# EAGLE schematic Flywheel Sensor Schematic (EAGLE 9.7.0)
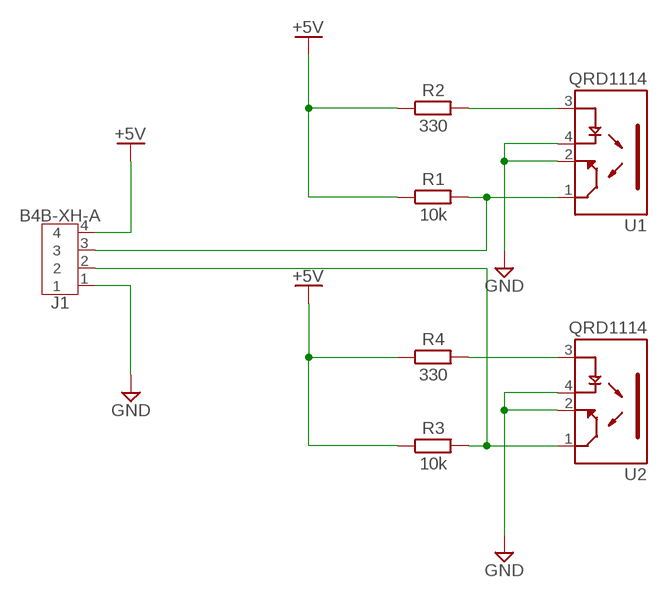
[diagram p0: schematic, sheet 1]

## Parts
J1  B4B-XH-A  [B4B-XH-A]
R1  10k  R_CHIP-0805(2012-METRIC)  [RESC2012X65]
R2  330  R_CHIP-0805(2012-METRIC)  [RESC2012X65]
R3  10k  R_CHIP-0805(2012-METRIC)  [RESC2012X65]
R4  330  R_CHIP-0805(2012-METRIC)  [RESC2012X65]
U1  QRD1114  [ONS_QRD1114]
U2  QRD1114  [ONS_QRD1114]

## Nets
+5V: J1.4 R1.1 R2.1 R3.1 R4.1
GND: J1.1 U1.2(ET) U1.4(C) U2.2(ET) U2.4(C)
N$1: J1.2 R3.2 U2.1(CT)
N$2: R4.2 U2.3(A)
N$3: J1.3 R1.2 U1.1(CT)
N$4: R2.2 U1.3(A)

## Library data of the parts
J1 = Connector:B4B-XH-A: XH Connector Top Entry - 4POS Details see: Datasheet <http://www.jst-mfg.com/product/pdf/eng/eXH.pdf>; CATEGORY: Header; DSECRIPTION: Connector Header Through Hole 4 position 0.098" (2.50mm); MANUFACTURER: JST Sales America Inc.; MPN: B4B-XH-A(LF)(SN); OPERATING_TEMPERATURE: -25 C to 85 C; PART_STATUS: ACTIVE; PITCH: 0.098" (2.50mm); ROHS_COMPLIANCE: ROHS3 Compliant; SERIES: XH; SUB_CATEGORY: Rectangular Connectors; TYPE: Header, Male Pin, Board to Cable/Wire, Through Hole
R1-R4 = Resistor:R: Resistor Fixed - Generic; CATEGORY: Resistor; SUB-CATEGORY: Fixed
U1 U2 = Library:QRD1114: QRD1114 Series 30 V 50 mA Phototransistor Reflective Object Sensor Check availability <https://pricing.snapeda.com/parts/QRD1114/ON%20Semiconductor%20/%20Fairchild/view-part?ref=eda>; AVAILABILITY: In Stock; CHECK_PRICES: https://www.snapeda.com/parts/QRD1114/Fairchild+Semiconductor/view-part/?ref=eda; DESCRIPTION: Optical Switches, Reflective, Phototransistor Output PHOTO TRANS; MF: ON Semiconductor / Fairchild; MP: QRD1114; PACKAGE: NON-STANDARD-4 ON Semiconductor; PRICE: None; SNAPEDA_LINK: https://www.snapeda.com/parts/QRD1114/Fairchild+Semiconductor/view-part/?ref=snap

## Net classes
0 default: width 0.5 mm, clearance 0.5 mm